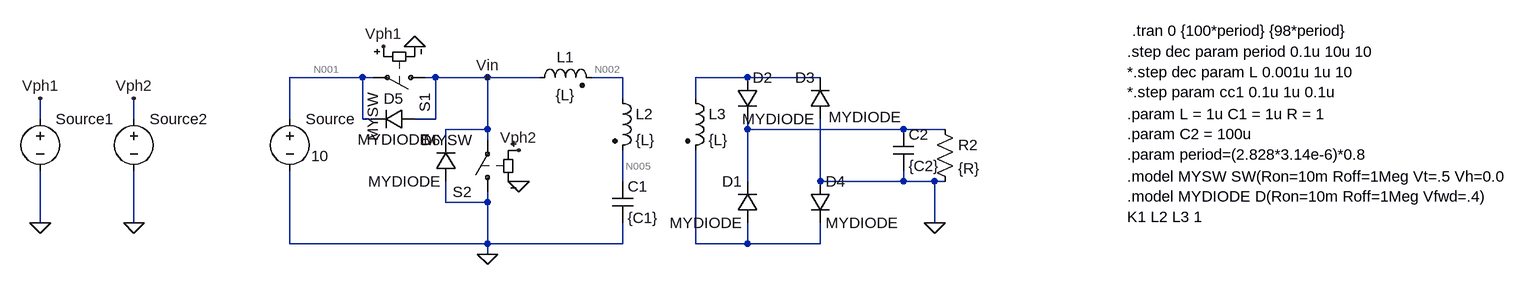
[diagram p0: schematic LLC_simple.asc]
LLC_simple.asc, the LTspice schematic file:
Version 4
SHEET 1 1688 680
WIRE -320 96 -432 96
WIRE -304 96 -320 96
WIRE -208 96 -224 96
WIRE -128 96 -208 96
WIRE -48 96 -128 96
WIRE 80 96 32 96
WIRE 272 96 192 96
WIRE 384 96 272 96
WIRE 80 128 80 96
WIRE 192 128 192 96
WIRE -816 160 -816 128
WIRE -672 160 -672 128
WIRE -432 160 -432 96
WIRE -320 160 -320 96
WIRE -304 160 -320 160
WIRE -208 160 -208 96
WIRE -208 160 -240 160
WIRE -128 176 -128 96
WIRE -128 176 -192 176
WIRE 272 176 272 160
WIRE 512 176 272 176
WIRE 576 176 512 176
WIRE -192 192 -192 176
WIRE -128 192 -128 176
WIRE 80 256 80 208
WIRE 272 256 272 176
WIRE 384 256 384 160
WIRE 512 256 512 240
WIRE 512 256 384 256
WIRE 560 256 512 256
WIRE 576 256 560 256
WIRE -192 288 -192 256
WIRE -128 288 -128 272
WIRE -128 288 -192 288
WIRE -816 320 -816 240
WIRE -672 320 -672 240
WIRE 560 320 560 256
WIRE -432 352 -432 240
WIRE -128 352 -128 288
WIRE -128 352 -432 352
WIRE 80 352 80 320
WIRE 80 352 -128 352
WIRE 192 352 192 208
WIRE 272 352 272 320
WIRE 272 352 192 352
WIRE 384 352 384 320
WIRE 384 352 272 352
WIRE -128 368 -128 352
FLAG -128 368 0
FLAG -128 96 Vin
FLAG 560 320 0
FLAG -816 320 0
FLAG -816 128 Vph1
FLAG -672 128 Vph2
FLAG -288 48 Vph1
FLAG -80 208 Vph2
FLAG -240 48 0
FLAG -80 256 0
FLAG -672 320 0
SYMBOL voltage -432 144 R0
WINDOW 123 0 0 Left 2
WINDOW 39 0 0 Left 2
WINDOW 3 33 73 Left 2
SYMATTR InstName Source
SYMATTR Value 10
SYMBOL cap 64 256 R0
SYMATTR InstName C1
SYMATTR Value {C1}
SYMATTR SpiceLine Rser=1m
SYMBOL ind2 -64 112 R270
WINDOW 0 32 56 VTop 2
WINDOW 3 5 56 VBottom 2
SYMATTR InstName L1
SYMATTR Value {L}
SYMATTR Type ind
SYMBOL ind2 64 112 R0
SYMATTR InstName L2
SYMATTR Value {L}
SYMATTR Type ind
SYMBOL ind2 176 112 R0
SYMATTR InstName L3
SYMATTR Value {L}
SYMATTR Type ind
SYMBOL res 560 160 R0
SYMATTR InstName R2
SYMATTR Value {R}
SYMBOL diode 288 320 R180
WINDOW 0 24 64 Left 2
WINDOW 3 24 0 Left 2
SYMATTR InstName D1
SYMATTR Value MYDIODE
SYMBOL diode 256 96 R0
WINDOW 3 141 61 Left 2
SYMATTR InstName D2
SYMATTR Value MYDIODE
SYMBOL diode 400 160 R180
WINDOW 0 24 64 Left 2
WINDOW 3 24 0 Left 2
SYMATTR InstName D3
SYMATTR Value MYDIODE
SYMBOL diode 368 256 R0
SYMATTR InstName D4
SYMATTR Value MYDIODE
SYMBOL cap 496 176 R0
SYMATTR InstName C2
SYMATTR Value {C2}
SYMBOL sw -208 96 R90
SYMATTR InstName S1
SYMATTR Value MYSW
SYMBOL sw -128 288 R180
SYMATTR InstName S2
SYMATTR Value MYSW
SYMBOL voltage -816 144 R0
WINDOW 123 0 0 Left 2
WINDOW 39 0 0 Left 2
WINDOW 3 -326 126 Invisible 2
SYMATTR InstName Source1
SYMATTR Value PULSE(0 1 0 1n 1n {period/2-10n} {period})
SYMBOL voltage -672 144 R0
WINDOW 123 0 0 Left 2
WINDOW 39 0 0 Left 2
WINDOW 3 -326 126 Invisible 2
SYMATTR InstName Source2
SYMATTR Value PULSE(0 1 {period/2} 1n 1n {period/2-10n} {period})
SYMBOL diode -240 144 R90
WINDOW 0 0 32 VBottom 2
WINDOW 3 32 32 VTop 2
SYMATTR InstName D5
SYMATTR Value MYDIODE
SYMBOL diode -176 256 R180
WINDOW 0 24 64 Left 2
WINDOW 3 24 0 Left 2
SYMATTR InstName D6
SYMATTR Value MYDIODE
TEXT 864 24 Left 2 !.tran 0 {100*period} {98*period}
TEXT 856 248 Left 2 !.model MYSW SW(Ron=10m Roff=1Meg Vt=.5 Vh=0.0\n.model MYDIODE D(Ron=10m Roff=1Meg Vfwd=.4)\nK1 L2 L3 1
TEXT 856 56 Left 2 !.step dec param period 0.1u 10u 10\n*.step dec param L 0.001u 1u 10\n*.step param cc1 0.1u 1u 0.1u
TEXT 856 152 Left 2 !.param L = 1u C1 = 1u R = 1\n.param C2 = 100u\n.param period=(2.828*3.14e-6)*0.8

The netlist it stands for:
* LLC_simple.asc
V§Source N001 0 10
C1 N005 0 {C1} Rser=1m
L1 Vin N002 {L}
L2 N002 N005 {L}
L3 N003 N006 {L}
R2 N004 0 {R}
D1 N006 N004 MYDIODE
D2 N003 N004 MYDIODE
D3 0 N003 MYDIODE
D4 0 N006 MYDIODE
C2 N004 0 {C2}
S1 Vin N001 Vph1 0 MYSW
S2 0 Vin Vph2 0 MYSW
V§Source1 Vph1 0 PULSE(0 1 0 1n 1n {period/2-10n} {period})
V§Source2 Vph2 0 PULSE(0 1 {period/2} 1n 1n {period/2-10n} {period})
D5 Vin N001 MYDIODE
D6 0 Vin MYDIODE
.model D D
.lib standard.dio
.tran 0 {100*period} {98*period}
.model MYSW SW(Ron=10m Roff=1Meg Vt=.5 Vh=0.0
.model MYDIODE D(Ron=10m Roff=1Meg Vfwd=.4)
K1 L2 L3 1
.step dec param period 0.1u 10u 10
*.step dec param L 0.001u 1u 10
*.step param cc1 0.1u 1u 0.1u
.param L = 1u C1 = 1u R = 1
.param C2 = 100u
.param period=(2.828*3.14e-6)*0.8
.backanno
.end

* Results of the author's LTspice run, read from the files saved beside the schematic
* Operating Point (first step), zero values left out:
*   period = 100 n
*   V(n001) = 10 V
*   V(n005) = 5 V
*   V(vin) = 5 V
*   V(n002) = 5 V
*   I(D6) = -5 µA
*   I(D5) = -5 µA
*   I(S2) = 5 µA
*   I(S1) = 5 µA
*   I(Source) = -10 µA
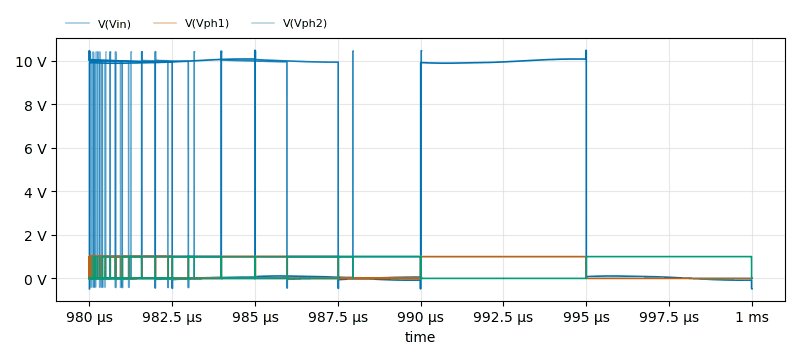
[diagram p1: Transient Analysis of LLC_simple.asc, plotted from the saved traces]
* Transient Analysis, 41 runs:
*   V(Vin) [run 1]: min -401.4 mV, max 10.4 V, average 5.01 V, rms 7.12 V, last 10.4 V
*   V(Vin) [run 2]: min -401.2 mV, max 10.4 V, average 5.002 V, rms 7.103 V, last 10.4 V
*   V(Vin) [run 3]: 10.4 V at time=980 µs, 10.4 V at time=980 µs, min 10.4 V, max 10.4 V
*   V(Vin) [run 4]: min -403.2 mV, max 10.4 V, average 4.999 V, rms 7.084 V, last 10.4 V
*   V(Vin) [run 5]: min -403.6 mV, max 10.4 V, average 5 V, rms 7.082 V, last 10.4 V
*   V(Vin) [run 6]: 10.41 V at time=980 µs, 10.41 V at time=980 µs, min 10.41 V, max 10.41 V
*   V(Vin) [run 7]: min -407.3 mV, max 10.41 V, average 5 V, rms 7.076 V, last 10.41 V
*   V(Vin) [run 8]: min -409.2 mV, max 10.41 V, average 5 V, rms 7.075 V, last 10.41 V
*   V(Vph1) [run 1]: min 0 V, max 1 V, average 410 mV, rms 638 mV, last 0 V
*   V(Vph1) [run 2]: min 0 V, max 1 V, average 428.6 mV, rms 652.8 mV, last 0 V
*   V(Vph1) [run 3]: 0 V at time=980 µs, 0 V at time=980 µs, min 0 V, max 0 V
*   V(Vph1) [run 4]: min 0 V, max 1 V, average 464.2 mV, rms 680.5 mV, last 0 V
*   V(Vph1) [run 5]: min 0 V, max 1 V, average 471.5 mV, rms 686 mV, last 0 V
*   V(Vph1) [run 6]: 79.26 mV at time=980 µs, 79.26 mV at time=980 µs, min 79.26 mV, max 79.26 mV
*   V(Vph1) [run 7]: min 0 V, max 1 V, average 485.7 mV, rms 696.6 mV, last 0 V
*   V(Vph1) [run 8]: min 0 V, max 1 V, average 488.7 mV, rms 698.8 mV, last 0 V
*   V(Vph2) [run 1]: min 0 V, max 1 V, average 410 mV, rms 638 mV, last 0 V
*   V(Vph2) [run 2]: min 0 V, max 1 V, average 428.6 mV, rms 652.8 mV, last 0 V
*   V(Vph2) [run 3]: 0 V at time=980 µs, 0 V at time=980 µs, min 0 V, max 0 V
*   V(Vph2) [run 4]: min 0 V, max 1 V, average 464.3 mV, rms 680.5 mV, last 0 V
*   V(Vph2) [run 5]: min 0 V, max 1 V, average 471.5 mV, rms 686 mV, last 0 V
*   V(Vph2) [run 6]: 0 V at time=980 µs, 0 V at time=980 µs, min 0 V, max 0 V
*   V(Vph2) [run 7]: min 0 V, max 1 V, average 485.7 mV, rms 696.6 mV, last 0 V
*   V(Vph2) [run 8]: min 0 V, max 1 V, average 488.7 mV, rms 698.8 mV, last 0 V